# Altium schematic sheet Amphenol ICC.SchDoc
size A4; SheetNumber: 3; SheetTotal: 4
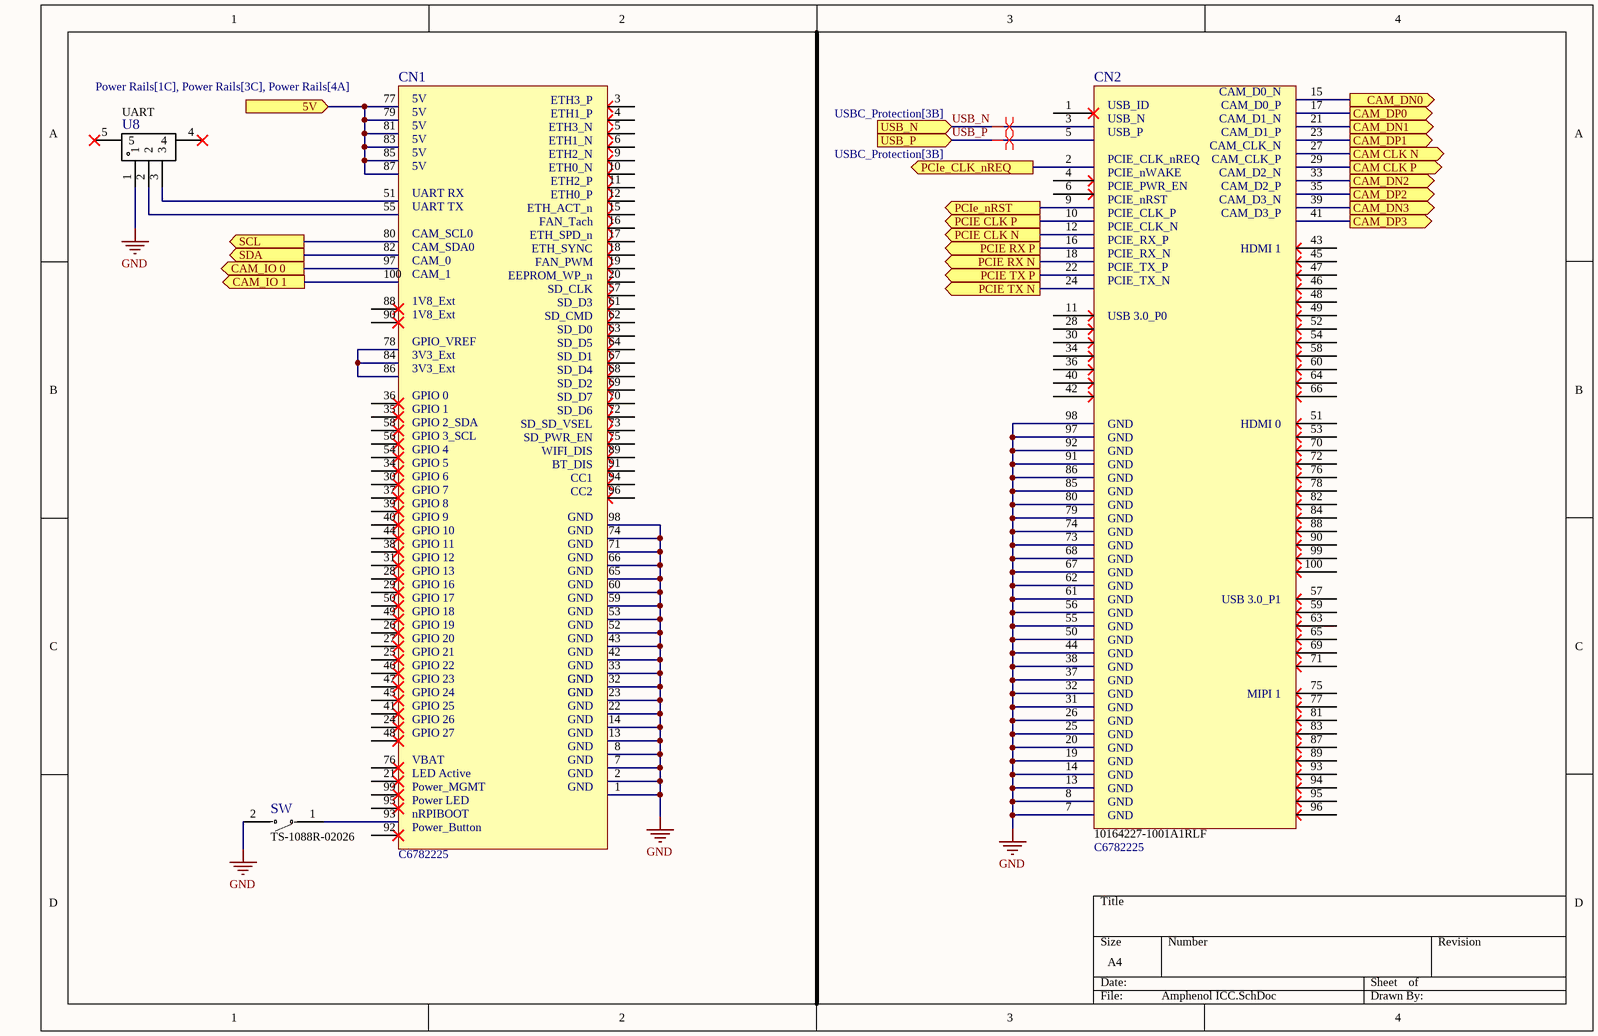
[diagram p0: Amphenol ICC.SchDoc]

## Parts
CN1  10164227-1001A1RLF  [CONN-SMD_100P-P0.40_10164227-1001A1RLF]  (value not drawn)
CN2  10164227-1001A1RLF  Name: C6782225  [CONN-SMD_100P-P0.40_10164227-1001A1RLF]
SW  TS-1088R-02026  [SW-SMD_L3.9-W3.0-P4.45]
U8  UART  [CONN-TH_SM03B-GHS-TB-LF-SN]

## Ports
5V (in, see Power Rails[1C], Power Rails[3C], Power Rails[4A]), CAM CLK N (out, see M.2 & CSI2[3B]), CAM CLK P (out, see M.2 & CSI2[3B]), CAM_DN0 (out, see M.2 & CSI2[3A]), CAM_DN1 (out, see M.2 & CSI2[3B]), CAM_DN2 (out, see M.2 & CSI2[3B]), CAM_DN3 (out, see M.2 & CSI2[3B]), CAM_DP0 (out, see M.2 & CSI2[3B]), CAM_DP1 (out, see M.2 & CSI2[3B]), CAM_DP2 (out, see M.2 & CSI2[3B]), CAM_DP3 (out, see M.2 & CSI2[3B]), CAM_IO 0 (out, see M.2 & CSI2[3B]), CAM_IO 1 (out, see M.2 & CSI2[3B]), PCIE CLK N (out, see M.2 & CSI2[1B]), PCIE CLK P (out, see M.2 & CSI2[1B]), PCIE RX N (out, see M.2 & CSI2[1B]), PCIE RX P (out, see M.2 & CSI2[1B]), PCIE TX N (out, see M.2 & CSI2[1B]), PCIE TX P (out, see M.2 & CSI2[1B]), PCIe_CLK_nREQ (out, see M.2 & CSI2[1C]), PCIe_nRST (out, see M.2 & CSI2[1C]), SCL (out, see M.2 & CSI2[3B]), SDA (out, see M.2 & CSI2[3B]), USB_N (in, see USBC_Protection[3B]), USB_P (in, see USBC_Protection[3B])

## Nets
GND: CN1.1 CN1.2 CN1.7 CN1.8 CN1.13 CN1.14 CN1.22 CN1.23 CN1.32 CN1.33 CN1.42 CN1.43 CN1.52 CN1.53 CN1.59 CN1.60 CN1.65 CN1.66 CN1.71 CN1.74 CN1.98 CN2.7(GND) CN2.8(GND) CN2.13(GND) CN2.14(GND) CN2.19(GND) CN2.20(GND) CN2.25(GND) CN2.26(GND) CN2.31(GND) CN2.32(GND) CN2.37(GND) CN2.38(GND) CN2.44(GND) CN2.50(GND) CN2.55(GND) CN2.56(GND) CN2.61(GND) CN2.62(GND) CN2.67(GND) CN2.68(GND) CN2.73(GND) CN2.74(GND) CN2.79(GND) CN2.80(GND) CN2.85(GND) CN2.86(GND) CN2.91(GND) CN2.92(GND) CN2.97(GND) CN2.98(GND) SW.2 U8.1
5V: CN1.77 CN1.79 CN1.81 CN1.83 CN1.85 CN1.87 ; port 5V
CAM CLK N: CN2.27(MIPI_C_N) ; port CAM CLK N
CAM CLK P: CN2.29(MIPI_C_P) ; port CAM CLK P
CAM_DN0: CN2.15(MIPI_D0_N) ; port CAM_DN0
CAM_DN1: CN2.21(MIPI_D1_N) ; port CAM_DN1
CAM_DN2: CN2.33(MIPI_D2_N) ; port CAM_DN2
CAM_DN3: CN2.39(MIPI_D3_N) ; port CAM_DN3
CAM_DP0: CN2.17(MIPI_D0_P) ; port CAM_DP0
CAM_DP1: CN2.23(MIPI_D1_P) ; port CAM_DP1
CAM_DP2: CN2.35(MIPI_D2_P) ; port CAM_DP2
CAM_DP3: CN2.41(MIPI_D3_P) ; port CAM_DP3
CAM_IO 0: CN1.97 ; port CAM_IO 0
CAM_IO 1: CN1.100 ; port CAM_IO 1
PCIE CLK N: CN2.12(PCIe_CLK_N) ; port PCIE CLK N
PCIE CLK P: CN2.10(PCIe_CLK_P) ; port PCIE CLK P
PCIE RX N: CN2.18(PCIe_RX_N) ; port PCIE RX N
PCIE RX P: CN2.16(PCIe_RX_P) ; port PCIE RX P
PCIE TX N: CN2.24(PCIe_TX_N) ; port PCIE TX N
PCIE TX P: CN2.22(PCIe_TX_P) ; port PCIE TX P
PCIe_CLK_nREQ: CN2.2(PCIe_CLK_REQ) ; port PCIe_CLK_nREQ
PCIe_nRST: CN2.9(PCIE_RST) ; port PCIe_nRST
SCL: CN1.80 ; port SCL
SDA: CN1.82 ; port SDA
USB_N: CN2.3(USB_N) ; port USB_N
USB_P: CN2.5(USB_P) ; port USB_P
NetCN1_51: CN1.51 U8.3
NetCN1_55: CN1.55 U8.2
NetCN1_78: CN1.78(GPIO_VREF) CN1.84 CN1.86
NetCN1_93: CN1.93 SW.1

Not connected (* = marked no-connect by the designer): CN1 3* 4* 5* 6* 9* 10* 11* 12* 15* 16* 17* 18* 19* 20* 21* 24* 25* 26* 27* 28* 29* 30* 31* 34* 35* 36* 37* 38* 39* 40* 41* 44* 45* 46* 47* 48* 49* 50* 54* 56* 57* 58* 61* 62* 63* 64* 67* 68* 69* 70* 72* 73* 75* 76* 88* 89* 90* 91* 92* 94* 95* 96* 99*; CN2 1(USB_ID)* 4(PCIe_WAKE)* 6(PCIE_PWR_EN)* 11(111)* 28(128)* 30(130)* 34(134)* 36(136)* 40(140)* 42(142)* 43(143)* 45(145)* 46(146)* 47(147)* 48(148)* 49(149)* 51(151)* 52(152)* 53(153)* 54(154)* 57(157)* 58(158)* 59(159)* 60(160)* 63(163)* 64(164)* 65(165)* 66(166)* 69(169)* 70(170)* 71(171)* 72(172)* 75(175)* 76(176)* 77(177)* 78(178)* 81(181)* 82(182)* 83(183)* 84(184)* 87(187)* 88(188)* 89(189)* 90(190)* 93(193)* 94(194)* 95(195)* 96(196)* 99(199)* 100(200)*; U8 4* 5*

## Layout directives
differential pair: USB_N, USB_P

## Notes on the sheet
- (in symbol 10164227-1001A1RLF) ETH3_P; 5V; ETH1_P; ETH3_N; ETH1_N; ETH2_N; ETH0_N; ETH2_P; ETH0_P; UART RX; ETH_ACT_n; UART TX; FAN_Tach; ETH_SPD_n; CAM_SCL0; ETH_SYNC; CAM_SDA0; FAN_PWM; CAM_0; EEPROM_WP_n; CAM_1; SD_CLK; SD_D3; 1V8_Ext; SD_CMD; SD_D0; SD_D5; SD_D1; 3V3_Ext; SD_D4; SD_D2; SD_D7; GPIO 0; SD_D6; GPIO 1; SD_SD_VSEL; GPIO 2_SDA; SD_PWR_EN; GPIO 3_SCL; WIFI_DIS; GPIO 4; BT_DIS; GPIO 5; CC1; GPIO 6; CC2; GPIO 7; GPIO 8; GPIO 9; GND; GPIO 10; GPIO 11; GPIO 12; GPIO 13; GPIO 16; GPIO 17; GPIO 18; GPIO 19; GPIO 20; GPIO 21; GPIO 22; GPIO 23; GPIO 24; GPIO 25; GPIO 26; GPIO 27; VBAT; LED Active; Power_MGMT; Power LED; nRPIBOOT; Power_Button; CAM_D0_N; CAM_D0_P; CAM_D1_N; CAM_D1_P; CAM_CLK_N; PCIE_CLK_nREQ; CAM_CLK_P; PCIE_nWAKE; CAM_D2_N; CAM_D2_P; PCIE_nRST; CAM_D3_N; PCIE_CLK_P; CAM_D3_P; PCIE_CLK_N; PCIE_RX_P; HDMI 1; PCIE_RX_N; PCIE_TX_P; PCIE_TX_N; USB 3.0_P0; HDMI 0; USB 3.0_P1; MIPI 1

## Library data of the parts
CN1 = 10164227-1001A1RLF: 100 Position Board to Board Connector Surface Mount,P=0.4mm Gold; Name: C6782225; Source: LCSC
CN2 = 10164227-1001A1RLF: 100 Position Board to Board Connector Surface Mount,P=0.4mm Gold; Source: LCSC
SW = TS-1088R-02026: Tactile Switch SPST 2mm 3.9mm x 2.93mm Surface Mount; Name: C455280; Source: LCSC
U8 = SM03B-GHS-TB_LF_SN: Connector Header 3 position 1.25mm Pitch 1A Surface Mount, Right Angle -25â„ƒ~+85â„ƒ; Name: C514175; Source: LCSC